# Altium schematic sheet BusAndInterfaceDesign.SchDoc
size A4; PageSetup: Record=PageOptions?CenterHorizontal=True?CenterVertical=True?PrintScale=1.00?XCorrection=1.00?YCorrection=1.00?PrintKind=0?BorderSize=5000000?LeftOffset=0?BottomOffset=0?Orientation=2?PaperLength=1000?PaperWidth=1000?Scale=100?PaperSource=7?PrintQuality=-4?MediaType=1?DitherType=10?PaperKind=A4?PrintScaleMode=1
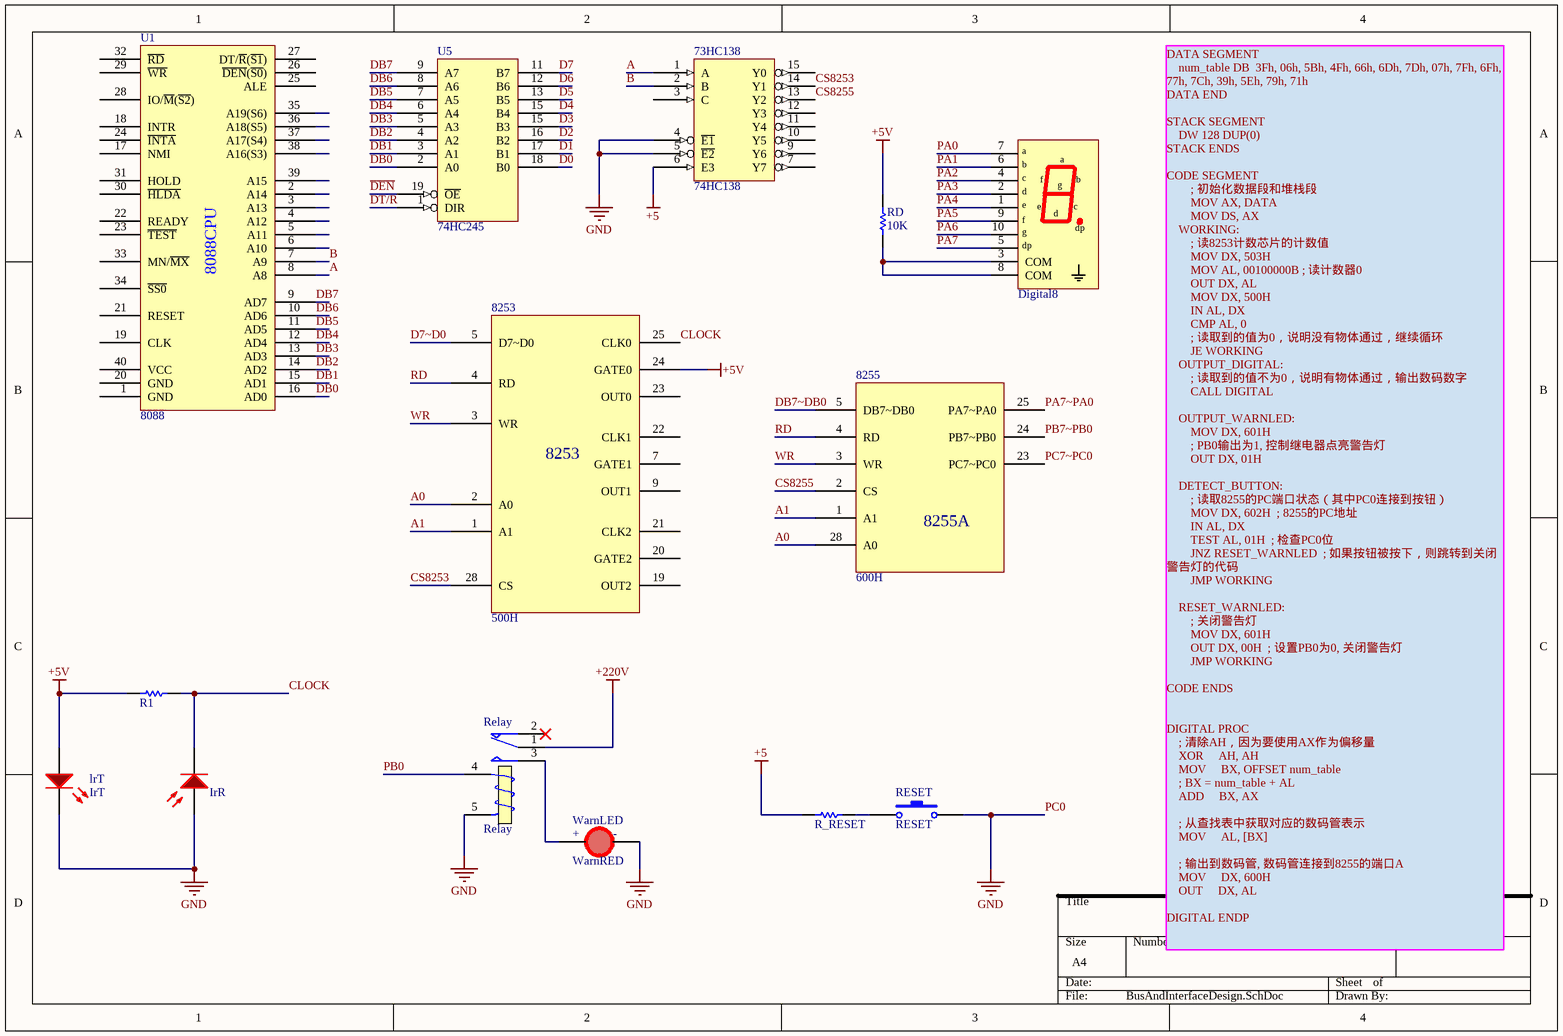
[diagram p0: BusAndInterfaceDesign.SchDoc]

## Parts
73HC138  74HC138  [BAID2]
8253  500H  [BAID2]
8255  600H  [BAID2]
*  Digital8
lrT  IrT  [BAID2]
R1  Res  [BAID2]  (value not drawn)
R_RESET  Res  [BAID2]  (value not drawn)
RD  10K  [0805]
Relay  Relay  [BAID2]
RESET  RESET  [BAID2]
U1  8088
U5  74HC245
WarnLED  WarnRED  [BAID2]
  IrR  [BAID2]

## Nets
+5: 73HC138.6(E3) R_RESET.1
+5V: 8253.24(GATE0) lrT.1(A) R1.1 RD.1
+220V: Relay.1(COM)
PC0: 73HC138.4(~{E1}) 73HC138.5(~{E2}) lrT.2(K) Relay.5(T2) RESET.2 WarnLED.2(K) .1(A)  [also labelled GND]
A: 73HC138.1(A) U1.8(A8)
A0: 8253.2(A0) 8255.28(A0)
A1: 8253.1(A1) 8255.1(A1)
B: 73HC138.2(B) U1.7(A9)
CLOCK: 8253.25(CLK0) R1.2 .2(K)
CS8253: 73HC138.14(Y1) 8253.28(CS)
CS8255: 73HC138.13(Y2) 8255.2(CS)
D0: U5.18(B0)
D1: U5.17(B1)
D2: U5.16(B2)
D3: U5.15(B3)
D4: U5.15(B4)
D5: U5.13(B5)
D6: U5.12(B6)
D7: U5.11(B7)
D7~D0: 8253.5(D7~D0)
~{DEN}: U5.19(~{OE})
DB0: U1.16(AD0) U5.2(A0)
DB1: U1.15(AD1) U5.3(A1)
DB2: U1.14(AD2) U5.4(A2)
DB3: U1.13(AD3) U5.5(A3)
DB4: U1.12(AD4) U5.6(A4)
DB5: U1.11(AD5) U5.7(A5)
DB6: U1.10(AD6) U5.8(A6)
DB7: U1.9(AD7) U5.9(A7)
DB7~DB0: 8255.5(DB7~DB0)
DT/~{R}: U5.1(DIR)
PA0: *.7(a)
PA1: *.6(b)
PA2: *.4(c)
PA3: *.2(d)
PA4: *.1(e)
PA5: *.9(f)
PA6: *.10(g)
PA7: *.5(dp)
PA7~PA0: 8255.25(PA7~PA0)
PB0: Relay.4(T1)
PB7~PB0: 8255.24(PB7~PB0)
PC7~PC0: 8255.23(PC7~PC0)
RD: 8253.4(RD) 8255.4(RD)
WR: 8253.3(WR) 8255.3(WR)
Net*_3: *.3(COM) *.8(COM) RD.2
NetR_RESET_2: R_RESET.2 RESET.1
NetRelay_3: Relay.3(NO) WarnLED.1(A)

Not connected (* = marked no-connect by the designer): 73HC138 3(C) 7(Y7) 9(Y6) 10(Y5) 11(Y4) 12(Y3) 15(Y0); 8253 7(GATE1) 9(OUT1) 19(OUT2) 20(GATE2) 21(CLK2) 22(CLK1) 23(OUT0); Relay 2(NC)*; U1 1(GND) 2(A14) 3(A13) 4(A12) 5(A11) 6(A10) 17(NMI) 18(INTR) 19(CLK) 20(GND) 21(RESET) 22(READY) 23(~{TEST}) 24(~{INTA}) 25(ALE) 26(~{DEN}(~{S0})) 27(DT/~{R}(~{S1})) 28(IO/~{M}(~{S2})) 29(~{WR}) 30(~{HLDA}) 31(HOLD) 32(~{RD}) 33(MN/~{MX}) 34(~{SS0}) 35(A19(S6)) 36(A18(S5)) 37(A17(S4)) 38(A16(S3)) 39(A15) 40(VCC)

## Notes on the sheet
- DATA SEGMENT
  num_table DB  3Fh, 06h, 5Bh, 4Fh, 66h, 6Dh, 7Dh, 07h, 7Fh, 6Fh, 77h, 7Ch, 39h, 5Eh, 79h, 71h
  DATA END
  STACK SEGMENT
  DW 128 DUP(0)
  STACK ENDS
  CODE SEGMENT
  ; 初始化数据段和堆栈段
  MOV AX, DATA
  MOV DS, AX
  WORKING:
  ; 读8253计数芯片的计数值
  MOV DX, 503H
  MOV AL, 00100000B ; 读计数器0
  OUT DX, AL
  MOV DX, 500H
  IN AL, DX
  CMP AL, 0
  ; 读取到的值为0，说明没有物体通过，继续循环
  JE WORKING
  OUTPUT_DIGITAL:
  ; 读取到的值不为0，说明有物体通过，输出数码数字
  CALL DIGITAL
  OUTPUT_WARNLED:
  MOV DX, 601H
  ; PB0输出为1, 控制继电器点亮警告灯
  OUT DX, 01H
  DETECT_BUTTON:
  ; 读取8255的PC端口状态（其中PC0连接到按钮）
  MOV DX, 602H  ; 8255的PC地址
  IN AL, DX
  TEST AL, 01H  ; 检查PC0位
  JNZ RESET_WARNLED  ; 如果按钮被按下，则跳转到关闭警告灯的代码
  JMP WORKING
  RESET_WARNLED:
  ; 关闭警告灯
  MOV DX, 601H
  OUT DX, 00H  ; 设置PB0为0, 关闭警告灯
  JMP WORKING
  CODE ENDS
  DIGITAL PROC
  ; 清除AH，因为要使用AX作为偏移量
  XOR     AH, AH
  MOV     BX, OFFSET num_table
  ; BX = num_table + AL
  ADD     BX, AX
  ; 从查找表中获取对应的数码管表示
  MOV     AL, [BX]
  ; 输出到数码管, 数码管连接到8255的端口A
  MOV     DX, 600H
  OUT     DX, AL
  DIGITAL ENDP
- (in symbol 8088) 8088CPU
- (in symbol WarnRED) +; -

## Library data of the parts
8253 = 8253
8255 = 8255A
RD = Res1: Resistor; Value: 330R; Published: 8-Jun-2000; LatestRevisionDate: 17-Jul-2002; LatestRevisionNote: Re-released for DXP Platform.; PackageReference: AXIAL-0.3; Publisher: Altium Limited; PackageDescription: Axial Device, Thru-Hole; 2 Leads; 0.3 in Pin Spacing